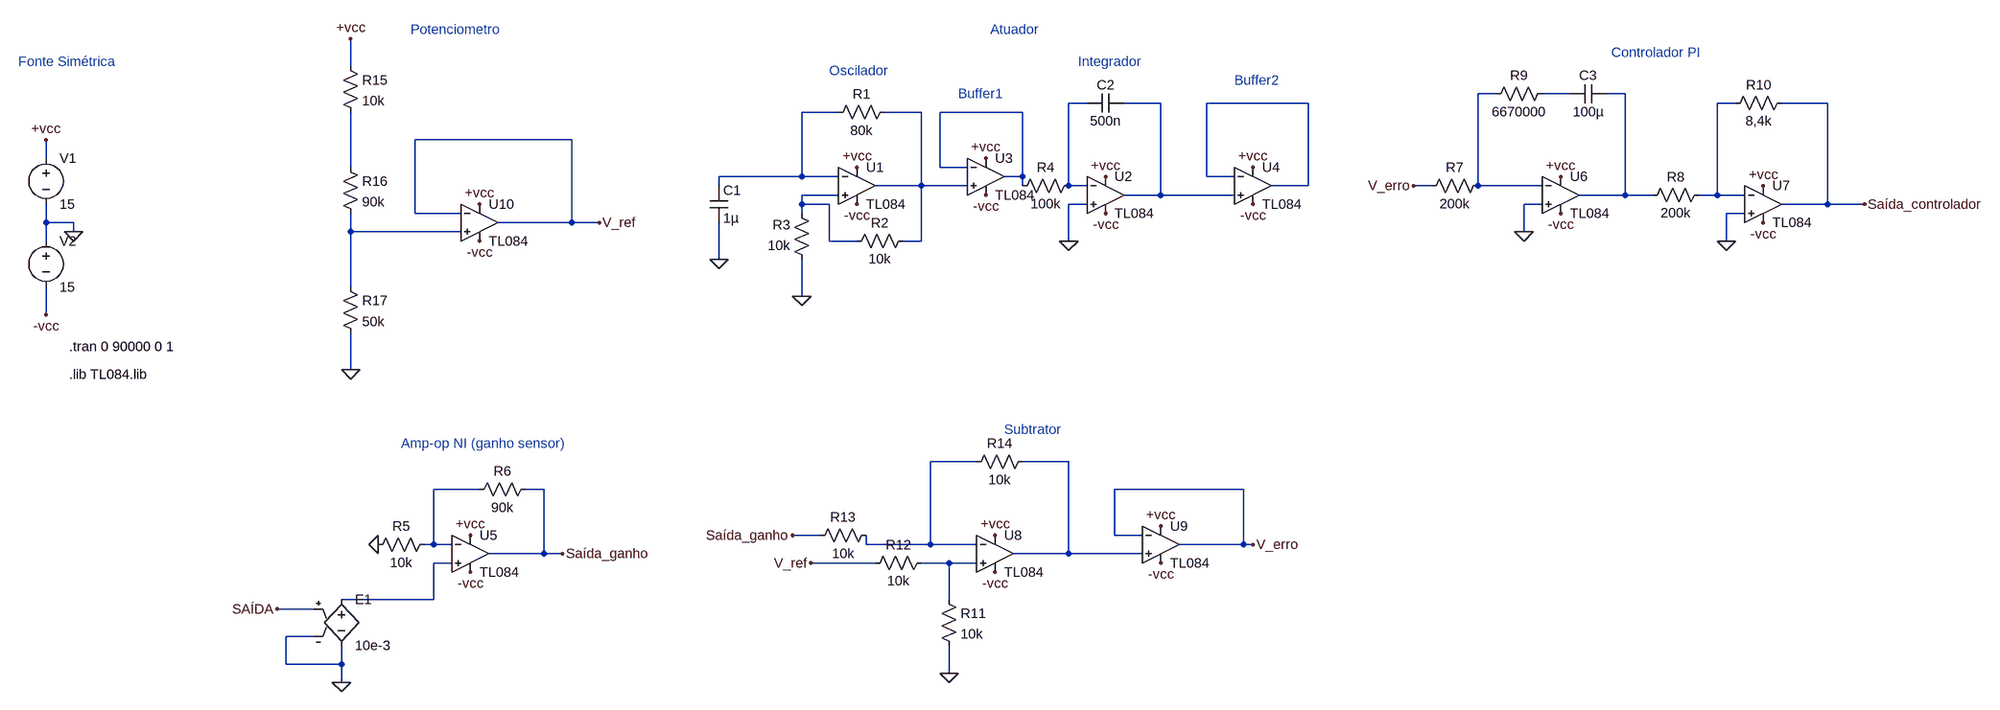
[diagram p0: schematic Projeto_Atuador_sensor_PI_Grupo2 EL.asc]
Projeto_Atuador_sensor_PI_Grupo2 EL.asc, the LTspice schematic file:
Version 4
SHEET 1 880 680
WIRE -3840 -2464 -3840 -2512
WIRE -1344 -2416 -1376 -2416
WIRE -1216 -2416 -1264 -2416
WIRE -1120 -2416 -1152 -2416
WIRE -2400 -2400 -2432 -2400
WIRE -2272 -2400 -2336 -2400
WIRE -2016 -2400 -2192 -2400
WIRE -928 -2400 -960 -2400
WIRE -768 -2400 -848 -2400
WIRE -2832 -2384 -2896 -2384
WIRE -2688 -2384 -2752 -2384
WIRE -2512 -2384 -2656 -2384
WIRE -3456 -2336 -3728 -2336
WIRE -4416 -2304 -4416 -2336
WIRE -3840 -2288 -3840 -2384
WIRE -2656 -2288 -2656 -2384
WIRE -2608 -2288 -2656 -2288
WIRE -2896 -2272 -2896 -2384
WIRE -2896 -2272 -3040 -2272
WIRE -2832 -2272 -2896 -2272
WIRE -2512 -2272 -2512 -2384
WIRE -2512 -2272 -2544 -2272
WIRE -2192 -2272 -2192 -2400
WIRE -2144 -2272 -2192 -2272
WIRE -3040 -2256 -3040 -2272
WIRE -2688 -2256 -2688 -2384
WIRE -2688 -2256 -2768 -2256
WIRE -2608 -2256 -2688 -2256
WIRE -2512 -2256 -2512 -2272
WIRE -2432 -2256 -2432 -2400
WIRE -2400 -2256 -2432 -2256
WIRE -2016 -2256 -2016 -2400
WIRE -2016 -2256 -2080 -2256
WIRE -1456 -2256 -1488 -2256
WIRE -1376 -2256 -1376 -2416
WIRE -1264 -2256 -1376 -2256
WIRE -2832 -2240 -2896 -2240
WIRE -2272 -2240 -2272 -2400
WIRE -2272 -2240 -2336 -2240
WIRE -2144 -2240 -2272 -2240
WIRE -1120 -2240 -1120 -2416
WIRE -1120 -2240 -1200 -2240
WIRE -1072 -2240 -1120 -2240
WIRE -960 -2240 -960 -2400
WIRE -960 -2240 -992 -2240
WIRE -912 -2240 -960 -2240
WIRE -2896 -2224 -2896 -2240
WIRE -2848 -2224 -2896 -2224
WIRE -2400 -2224 -2432 -2224
WIRE -1264 -2224 -1296 -2224
WIRE -768 -2224 -768 -2400
WIRE -768 -2224 -848 -2224
WIRE -704 -2224 -768 -2224
WIRE -3728 -2208 -3728 -2336
WIRE -3648 -2208 -3728 -2208
WIRE -2896 -2208 -2896 -2224
WIRE -912 -2208 -944 -2208
WIRE -4416 -2192 -4416 -2224
WIRE -4368 -2192 -4416 -2192
WIRE -3456 -2192 -3456 -2336
WIRE -3456 -2192 -3584 -2192
WIRE -3408 -2192 -3456 -2192
WIRE -4368 -2176 -4368 -2192
WIRE -3840 -2176 -3840 -2208
WIRE -3648 -2176 -3840 -2176
WIRE -1296 -2176 -1296 -2224
WIRE -4416 -2160 -4416 -2192
WIRE -2848 -2160 -2848 -2224
WIRE -2800 -2160 -2848 -2160
WIRE -2688 -2160 -2688 -2256
WIRE -2688 -2160 -2720 -2160
WIRE -2432 -2160 -2432 -2224
WIRE -944 -2160 -944 -2208
WIRE -3040 -2128 -3040 -2192
WIRE -3840 -2080 -3840 -2176
WIRE -2896 -2064 -2896 -2128
WIRE -4416 -2032 -4416 -2080
WIRE -3840 -1936 -3840 -2000
WIRE -2592 -1776 -2672 -1776
WIRE -2432 -1776 -2512 -1776
WIRE -3616 -1728 -3696 -1728
WIRE -3504 -1728 -3536 -1728
WIRE -2128 -1728 -2352 -1728
WIRE -2864 -1648 -2912 -1648
WIRE -2352 -1648 -2352 -1728
WIRE -2304 -1648 -2352 -1648
WIRE -3696 -1632 -3696 -1728
WIRE -3696 -1632 -3712 -1632
WIRE -3664 -1632 -3696 -1632
WIRE -2784 -1632 -2784 -1648
WIRE -2672 -1632 -2672 -1776
WIRE -2672 -1632 -2784 -1632
WIRE -2592 -1632 -2672 -1632
WIRE -2128 -1632 -2128 -1728
WIRE -2128 -1632 -2240 -1632
WIRE -2112 -1632 -2128 -1632
WIRE -3504 -1616 -3504 -1728
WIRE -3504 -1616 -3600 -1616
WIRE -3472 -1616 -3504 -1616
WIRE -2432 -1616 -2432 -1776
WIRE -2432 -1616 -2528 -1616
WIRE -2304 -1616 -2432 -1616
WIRE -3664 -1600 -3696 -1600
WIRE -2768 -1600 -2880 -1600
WIRE -2640 -1600 -2688 -1600
WIRE -2592 -1600 -2640 -1600
WIRE -3696 -1536 -3696 -1600
WIRE -3696 -1536 -3856 -1536
WIRE -2640 -1536 -2640 -1600
WIRE -3904 -1520 -3968 -1520
WIRE -3904 -1472 -3952 -1472
WIRE -3952 -1424 -3952 -1472
WIRE -3856 -1424 -3856 -1456
WIRE -3856 -1424 -3952 -1424
WIRE -2640 -1408 -2640 -1456
WIRE -3856 -1392 -3856 -1424
FLAG -4368 -2176 0
FLAG -4416 -2336 +vcc
FLAG -4416 -2032 -vcc
FLAG -3040 -2128 0
FLAG -2896 -2064 0
FLAG -2800 -2288 +vcc
FLAG -2800 -2224 -vcc
FLAG -2432 -2160 0
FLAG -2576 -2304 +vcc
FLAG -2368 -2272 +vcc
FLAG -2112 -2288 +vcc
FLAG -2576 -2240 -vcc
FLAG -2368 -2208 -vcc
FLAG -2112 -2224 -vcc
FLAG -3632 -1648 +vcc
FLAG -3632 -1584 -vcc
FLAG -3792 -1632 0
FLAG -3472 -1616 Saída_ganho
FLAG -1232 -2272 +vcc
FLAG -880 -2256 +vcc
FLAG -1232 -2208 -vcc
FLAG -880 -2192 -vcc
FLAG -1296 -2176 0
FLAG -944 -2160 0
FLAG -1488 -2256 V_erro
FLAG -704 -2224 Saída_controlador
FLAG -3856 -1392 0
FLAG -3968 -1520 SAÍDA
FLAG -2560 -1648 +vcc
FLAG -2560 -1584 -vcc
FLAG -2640 -1408 0
FLAG -2912 -1648 Saída_ganho
FLAG -2880 -1600 V_ref
FLAG -2272 -1664 +vcc
FLAG -2272 -1600 -vcc
FLAG -2112 -1632 V_erro
FLAG -3616 -2224 +vcc
FLAG -3616 -2160 -vcc
FLAG -3840 -1936 0
FLAG -3840 -2512 +vcc
FLAG -3408 -2192 V_ref
SYMBOL voltage -4416 -2320 R0
WINDOW 123 0 0 Left 0
WINDOW 39 0 0 Left 0
SYMATTR InstName V1
SYMATTR Value 15
SYMBOL voltage -4416 -2176 R0
WINDOW 123 0 0 Left 0
WINDOW 39 0 0 Left 0
SYMATTR InstName V2
SYMATTR Value 15
SYMBOL OpAmps\\opamp2 -2800 -2320 R0
SYMATTR InstName U1
SYMATTR Value TL084
SYMBOL res -2736 -2400 R90
WINDOW 0 0 56 VBottom 2
WINDOW 3 32 56 VTop 2
SYMATTR InstName R1
SYMATTR Value 80k
SYMBOL res -2704 -2176 R90
WINDOW 0 0 56 VBottom 2
WINDOW 3 32 56 VTop 2
SYMATTR InstName R2
SYMATTR Value 10k
SYMBOL res -2880 -2112 R180
WINDOW 0 36 76 Left 2
WINDOW 3 36 40 Left 2
SYMATTR InstName R3
SYMATTR Value 10k
SYMBOL cap -3056 -2256 R0
SYMATTR InstName C1
SYMATTR Value 1µ
SYMBOL OpAmps\\opamp2 -2368 -2304 R0
SYMATTR InstName U2
SYMATTR Value TL084
SYMBOL cap -2336 -2416 R90
WINDOW 0 0 32 VBottom 2
WINDOW 3 32 32 VTop 2
SYMATTR InstName C2
SYMATTR Value 500n
SYMBOL res -2416 -2272 R90
WINDOW 0 0 56 VBottom 2
WINDOW 3 32 56 VTop 2
SYMATTR InstName R4
SYMATTR Value 100k
SYMBOL OpAmps\\opamp2 -2576 -2336 R0
SYMATTR InstName U3
SYMATTR Value TL084
SYMBOL OpAmps\\opamp2 -2112 -2320 R0
SYMATTR InstName U4
SYMATTR Value TL084
SYMBOL OpAmps\\opamp2 -3632 -1680 R0
SYMATTR InstName U5
SYMATTR Value TL084
SYMBOL res -3696 -1648 R90
WINDOW 0 0 56 VBottom 2
WINDOW 3 32 56 VTop 2
SYMATTR InstName R5
SYMATTR Value 10k
SYMBOL res -3520 -1744 R90
WINDOW 0 0 56 VBottom 2
WINDOW 3 32 56 VTop 2
SYMATTR InstName R6
SYMATTR Value 90k
SYMBOL OpAmps\\opamp2 -1232 -2304 R0
SYMATTR InstName U6
SYMATTR Value TL084
SYMBOL OpAmps\\opamp2 -880 -2288 R0
SYMATTR InstName U7
SYMATTR Value TL084
SYMBOL res -1360 -2272 R90
WINDOW 0 0 56 VBottom 2
WINDOW 3 32 56 VTop 2
SYMATTR InstName R7
SYMATTR Value 200k
SYMBOL res -976 -2256 R90
WINDOW 0 0 56 VBottom 2
WINDOW 3 32 56 VTop 2
SYMATTR InstName R8
SYMATTR Value 200k
SYMBOL res -1248 -2432 R90
WINDOW 0 0 56 VBottom 2
WINDOW 3 32 56 VTop 2
SYMATTR InstName R9
SYMATTR Value 6670000
SYMBOL res -832 -2416 R90
WINDOW 0 0 56 VBottom 2
WINDOW 3 32 56 VTop 2
SYMATTR InstName R10
SYMATTR Value 8,4k
SYMBOL cap -1216 -2400 R270
WINDOW 0 32 32 VTop 2
WINDOW 3 0 32 VBottom 2
SYMATTR InstName C3
SYMATTR Value 100µ
SYMBOL e -3856 -1552 R0
SYMATTR InstName E1
SYMATTR Value 10e-3
SYMBOL OpAmps\\opamp2 -2560 -1680 R0
SYMATTR InstName U8
SYMATTR Value TL084
SYMBOL res -2656 -1552 R0
SYMATTR InstName R11
SYMATTR Value 10k
SYMBOL res -2672 -1616 R90
WINDOW 0 0 56 VBottom 2
WINDOW 3 32 56 VTop 2
SYMATTR InstName R12
SYMATTR Value 10k
SYMBOL res -2768 -1664 R90
WINDOW 0 0 56 VBottom 2
WINDOW 3 32 56 VTop 2
SYMATTR InstName R13
SYMATTR Value 10k
SYMBOL res -2496 -1792 R90
WINDOW 0 0 56 VBottom 2
WINDOW 3 32 56 VTop 2
SYMATTR InstName R14
SYMATTR Value 10k
SYMBOL OpAmps\\opamp2 -2272 -1696 R0
SYMATTR InstName U9
SYMATTR Value TL084
SYMBOL OpAmps\\opamp2 -3616 -2256 R0
SYMATTR InstName U10
SYMATTR Value TL084
SYMBOL res -3856 -2480 R0
SYMATTR InstName R15
SYMATTR Value 10k
SYMBOL res -3856 -2304 R0
SYMATTR InstName R16
SYMATTR Value 90k
SYMBOL res -3856 -2096 R0
SYMATTR InstName R17
SYMATTR Value 50k
TEXT -4376 -1928 Left 2 !.lib TL084.lib
TEXT -4376 -1976 Left 2 !.tran 0 90000 0 1
TEXT -2568 -2528 Left 2 ;Atuador
TEXT -4464 -2472 Left 2 ;Fonte Simétrica
TEXT -2848 -2456 Left 2 ;Oscilador
TEXT -2416 -2472 Left 2 ;Integrador
TEXT -2144 -2440 Left 2 ;Buffer2
TEXT -2624 -2416 Left 2 ;Buffer1
TEXT -3752 -1808 Left 2 ;Amp-op NI (ganho sensor)
TEXT -1144 -2488 Left 2 ;Controlador PI
TEXT -2544 -1832 Left 2 ;Subtrator
TEXT -3736 -2528 Left 2 ;Potenciometro

The netlist it stands for:
* Projeto_Atuador_sensor_PI_Grupo2 EL.asc
V1 +vcc 0 15
V2 0 -vcc 15
XU1 N012 N008 +vcc -vcc N009 TL084  ; pins In+ In- V+ V- OUT
R1 N009 N008 80k
R2 N009 N012 10k
R3 0 N012 10k
C1 N008 0 1µ
XU2 0 N004 +vcc -vcc N005 TL084  ; pins In+ In- V+ V- OUT
C2 N005 N004 500n
R4 N004 N010 100k
XU3 N009 N010 +vcc -vcc N010 TL084  ; pins In+ In- V+ V- OUT
XU4 N005 N006 +vcc -vcc N006 TL084  ; pins In+ In- V+ V- OUT
XU5 N017 N016 +vcc -vcc Saída_ganho TL084  ; pins In+ In- V+ V- OUT
R5 N016 0 10k
R6 Saída_ganho N016 90k
XU6 0 N001 +vcc -vcc N003 TL084  ; pins In+ In- V+ V- OUT
XU7 0 N007 +vcc -vcc Saída_controlador TL084  ; pins In+ In- V+ V- OUT
R7 N001 V_erro 200k
R8 N007 N003 200k
R9 N002 N001 6670000
R10 Saída_controlador N007 8,4k
C3 N002 N003 100µ
E1 N017 0 SAÍDA 0 10e-3
XU8 N018 N014 +vcc -vcc N015 TL084  ; pins In+ In- V+ V- OUT
R11 N018 0 10k
R12 N018 V_ref 10k
R13 N014 Saída_ganho 10k
R14 N015 N014 10k
XU9 N015 V_erro +vcc -vcc V_erro TL084  ; pins In+ In- V+ V- OUT
XU10 N013 V_ref +vcc -vcc V_ref TL084  ; pins In+ In- V+ V- OUT
R15 +vcc N011 10k
R16 N011 N013 90k
R17 N013 0 50k
.lib TL084.lib
.tran 0 90000 0 1
* Atuador
* Fonte Simétrica
* Oscilador
* Integrador
* Buffer2
* Buffer1
* Amp-op NI (ganho sensor)
* Controlador PI
* Subtrator
* Potenciometro
.backanno
.end